# Altium schematic sheet Sheet1.SchDoc
size A
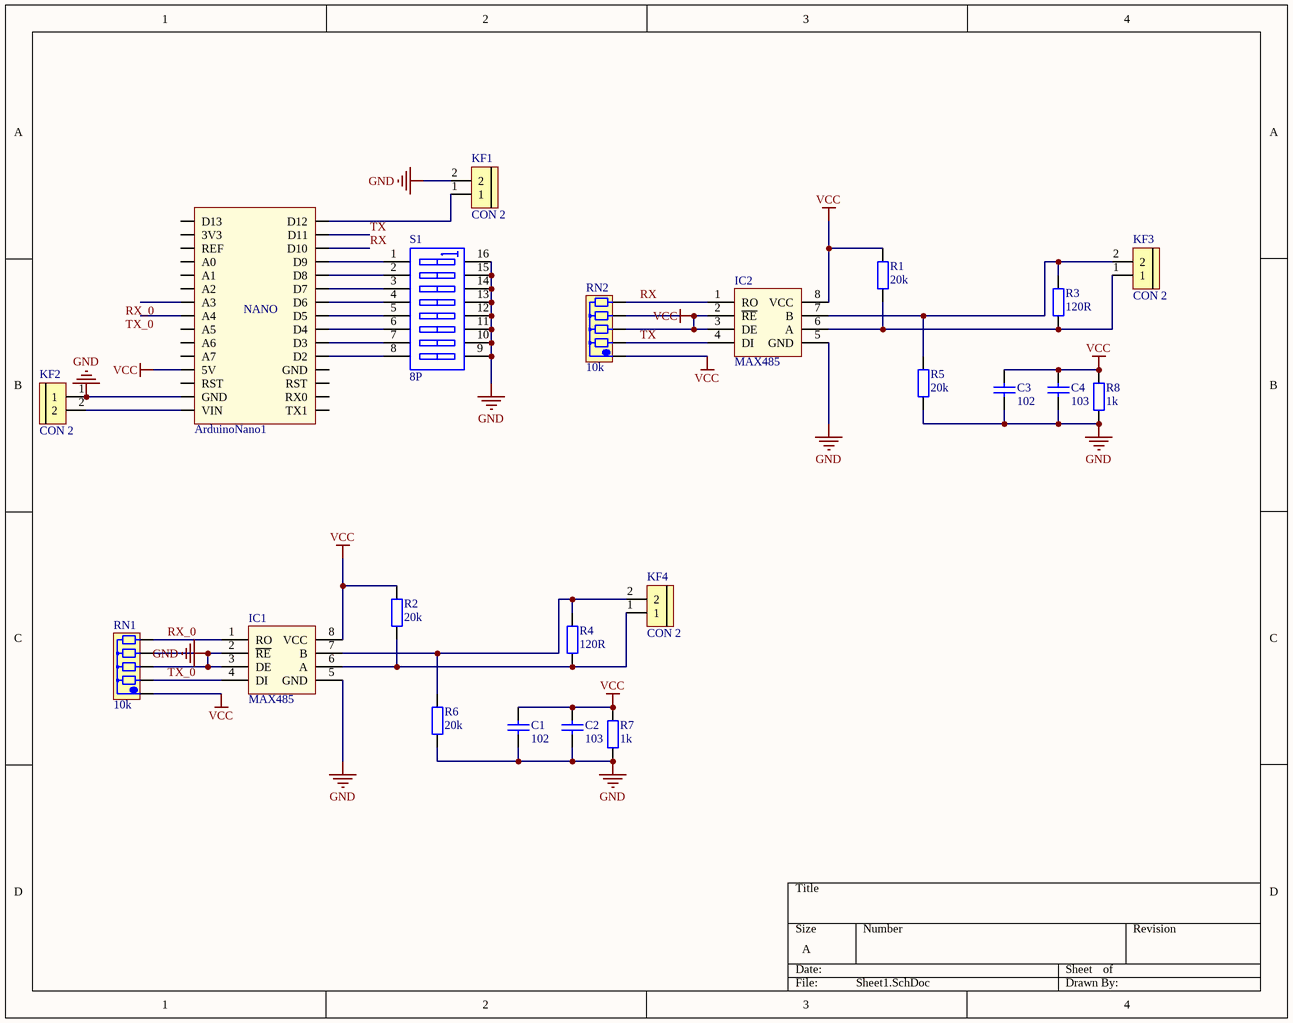
[diagram p0: Sheet1.SchDoc]

## Parts
ArduinoNano1  Arduino Nano  [Arduino Nano]  (value not drawn)
C1  102  [tu gom]
C2  103  [tu gom]
C3  102  [tu gom]
C4  103  [tu gom]
IC1  MAX485  [DIP8/W0.3]
IC2  MAX485  [DIP8/W0.3]
KF1  CON 2  [Con 2 KF301 5.08]
KF2  CON 2  [Con 2 KF301 5.08]
KF3  CON 2  [Con 2 KF301 5.08]
KF4  CON 2  [Con 2 KF301 5.08]
R1  20k  [tro vach 1/4w]
R2  20k  [tro vach 1/4w]
R3  120R  [tro vach 1/4w]
R4  120R  [tro vach 1/4w]
R5  20k  [tro vach 1/4w]
R6  20k  [tro vach 1/4w]
R7  1k  [tro vach 1/4w]
R8  1k  [tro vach 1/4w]
RN1  10k  [RN4]
RN2  10k  [RN4]
S1  8P  [SW-DIP8]

## Nets
GND: ArduinoNano1.GND C1.2 C2.2 C3.2 C4.2 IC1.2(~{RE}) IC1.3(DE) IC1.5(GND) IC2.5(GND) KF1.2 KF2.1 R5.1 R6.1 R7.1 R8.1 RN1.3 RN1.4 S1.9(B8) S1.10(B7) S1.11(B6) S1.12(B5) S1.13(B4) S1.14(B3) S1.15(B2) S1.16(B1)
VCC: ArduinoNano1.5V C1.1 C2.1 C3.1 C4.1 IC1.8(VCC) IC2.2(~{RE}) IC2.3(DE) IC2.8(VCC) R1.2 R2.2 R7.2 R8.2 RN1.1 RN2.1 RN2.3 RN2.4
RX: ArduinoNano1.D10 IC2.1(RO) RN2.5
RX_0: ArduinoNano1.A3 IC1.1(RO) RN1.5
TX: ArduinoNano1.D11 IC2.4(DI) RN2.2
TX_0: ArduinoNano1.A4 IC1.4(DI) RN1.2
NetArduinoNano1_D2: ArduinoNano1.D2 S1.8(A8)
NetArduinoNano1_D3: ArduinoNano1.D3 S1.7(A7)
NetArduinoNano1_D4: ArduinoNano1.D4 S1.6(A6)
NetArduinoNano1_D5: ArduinoNano1.D5 S1.5(A5)
NetArduinoNano1_D6: ArduinoNano1.D6 S1.4(A4)
NetArduinoNano1_D7: ArduinoNano1.D7 S1.3(A3)
NetArduinoNano1_D8: ArduinoNano1.D8 S1.2(A2)
NetArduinoNano1_D9: ArduinoNano1.D9 S1.1(A1)
NetArduinoNano1_D12: ArduinoNano1.D12 KF1.1
NetArduinoNano1_VIN: ArduinoNano1.VIN KF2.2
NetIC1_6: IC1.6(A) KF4.1 R2.1 R4.1
NetIC1_7: IC1.7(B) KF4.2 R4.2 R6.2
NetIC2_6: IC2.6(A) KF3.1 R1.1 R3.1
NetIC2_7: IC2.7(B) KF3.2 R3.2 R5.2

Not connected (* = marked no-connect by the designer): ArduinoNano1 3V3 A0 A1 A2 A5 A6 A7 D13 REF RST RX0 TX1

## Notes on the sheet
- (in symbol Arduino Nano) NANO

## Library data of the parts
ArduinoNano1 = Arduino Nano: Value: Cau 1A
C1 C3 = Tu gom 102 50V: Cắm; Don_Vi: Con; So_Chan: 2; Ten_Linh_Kien: Tụ gốm 102 1nF 50V; Ma_Hang: MH004763; Chung_Loai: Cắm; Kieu_Chan: *
C2 C4 = Tu gom 103 50V: Cắm; So_Chan: 2; Ten_Linh_Kien: Tụ gốm 103 10nF 50V; Don_Vi: Con; Ma_Hang: MH000936; Chung_Loai: Cắm; Kieu_Chan: *
IC1 IC2 = MAX485: RS232 - RS485 (Same sn75176)
KF1-KF4 = CON 2 KF301: Cắm; Ma_Hang: MH000987; Ten_Linh_Kien: CON 2 KF301-2P 5.08MM Xanh Dương; Chung_Loai: Cắm; Ghi_Chu: *; Kieu_Chan: *; Don_Vi: Con
R1 R2 R5 R6 = Tro Vach 1/4W 5% 20k: Cắm; Don_Vi: Con; So_Chan: 2; Ten_Linh_Kien: Trở Vạch 1/4w 5% 20k; Ma_Hang: MH007297; Chung_Loai: Cắm; Kieu_Chan: *
R3 R4 = Tro Vach 1/4W 5% 120R: Cắm; Don_Vi: Con; So_Chan: 2; Ten_Linh_Kien: Trở Vạch 1/4W 5% 120R; Ma_Hang: MH007388; Chung_Loai: Cắm; Kieu_Chan: *
R7 R8 = Tro Vach 1/4W 5% 1k: Cắm; Don_Vi: Con; So_Chan: 2; Ten_Linh_Kien: Trở Vạch 1/4w 5% 1k; Ma_Hang: MH007390; Chung_Loai: Cắm; Kieu_Chan: *
RN1 RN2 = RN4: Resistor 4 (thanh); Value: Tro thanh 4K7
S1 = Cong Tac Bits 8P: Cắm; Ten_Linh_Kien: Switch Số 8P ( Công Tắc Bit 8P); Don_Vi: Con; Ma_Hang: MH000971; Kieu_Chan: *; Ghi_Chu: *; Chung_Loai: Cắm